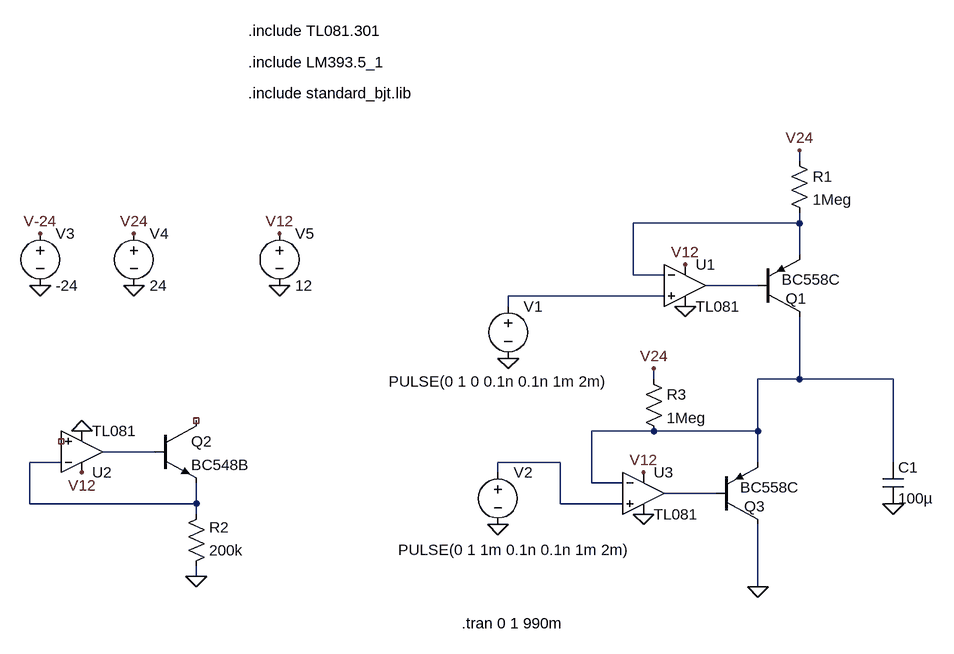
[diagram p0: schematic Fuentes_salida_flipflop.asc]
Fuentes_salida_flipflop.asc, the LTspice schematic file:
Version 4
SHEET 1 1304 908
WIRE 464 -64 464 -80
WIRE 464 32 464 16
WIRE 464 32 208 32
WIRE 464 80 464 32
WIRE 208 112 208 32
WIRE 256 112 208 112
WIRE 400 128 320 128
WIRE 256 144 16 144
WIRE 16 160 16 144
WIRE 240 272 240 256
WIRE 464 272 464 176
WIRE 464 272 400 272
WIRE 608 272 464 272
WIRE 240 352 144 352
WIRE 400 352 400 272
WIRE 400 352 240 352
WIRE -528 384 -608 384
WIRE -672 400 -720 400
WIRE 96 400 0 400
WIRE 400 400 400 352
WIRE 608 400 608 272
WIRE 0 416 0 400
WIRE 144 432 144 352
WIRE 192 432 144 432
WIRE 336 448 256 448
WIRE -720 464 -720 400
WIRE -464 464 -464 432
WIRE -464 464 -720 464
WIRE 96 464 96 400
WIRE 192 464 96 464
WIRE -464 480 -464 464
WIRE -464 576 -464 560
WIRE 400 592 400 496
FLAG 608 464 0
FLAG 464 -80 V24
FLAG 288 160 0
FLAG -640 352 0
FLAG 288 96 V12
FLAG -640 416 V12
FLAG 0 496 0
FLAG 16 240 0
FLAG -704 128 0
FLAG -560 128 0
FLAG -704 48 V-24
FLAG -560 48 V24
FLAG -336 128 0
FLAG -336 48 V12
FLAG -464 576 0
FLAG 240 256 V24
FLAG 224 480 0
FLAG 224 416 V12
FLAG 400 592 0
SYMBOL cap 592 400 R0
SYMATTR InstName C1
SYMATTR Value 100µ
SYMBOL Opamps\\opamp2 288 64 R0
SYMATTR InstName U1
SYMATTR Value TL081
SYMBOL Opamps\\opamp2 -640 448 M180
SYMATTR InstName U2
SYMATTR Value TL081
SYMBOL pnp 400 176 M180
WINDOW 0 43 28 Left 2
WINDOW 3 37 57 Left 2
SYMATTR InstName Q1
SYMATTR Value BC558C
SYMBOL res 448 -80 R0
SYMATTR InstName R1
SYMATTR Value 1Meg
SYMBOL res -480 576 M180
WINDOW 0 36 76 Left 2
WINDOW 3 36 40 Left 2
SYMATTR InstName R2
SYMATTR Value 200k
SYMBOL npn -528 336 R0
SYMATTR InstName Q2
SYMATTR Value BC548B
SYMBOL voltage 16 144 R0
WINDOW 123 0 0 Left 0
WINDOW 39 0 0 Left 0
WINDOW 3 -184 132 Left 2
SYMATTR InstName V1
SYMATTR Value PULSE(0 1 0 0.1n 0.1n 1m 2m)
SYMBOL voltage 0 400 R0
WINDOW 123 0 0 Left 0
WINDOW 39 0 0 Left 0
WINDOW 3 -153 135 Left 2
SYMATTR InstName V2
SYMATTR Value PULSE(0 1 1m 0.1n 0.1n 1m 2m)
SYMBOL voltage -704 32 R0
WINDOW 123 0 0 Left 0
WINDOW 39 0 0 Left 0
SYMATTR InstName V3
SYMATTR Value -24
SYMBOL voltage -560 32 R0
WINDOW 123 0 0 Left 0
WINDOW 39 0 0 Left 0
SYMATTR InstName V4
SYMATTR Value 24
SYMBOL voltage -336 32 R0
WINDOW 123 0 0 Left 0
WINDOW 39 0 0 Left 0
SYMATTR InstName V5
SYMATTR Value 12
SYMBOL Opamps\\opamp2 224 384 R0
SYMATTR InstName U3
SYMATTR Value TL081
SYMBOL pnp 336 496 M180
WINDOW 0 43 28 Left 2
WINDOW 3 37 57 Left 2
SYMATTR InstName Q3
SYMATTR Value BC558C
SYMBOL res 224 256 R0
SYMATTR InstName R3
SYMATTR Value 1Meg
TEXT -56 648 Left 2 !.tran 0 1 990m
TEXT -384 -168 Left 2 !.include standard_bjt.lib
TEXT -384 -216 Left 2 !.include LM393.5_1
TEXT -384 -264 Left 2 !.include TL081.301

The netlist it stands for:
* Fuentes_salida_flipflop.asc
C1 N004 0 100µ
XU1 N003 N001 V12 0 N002 TL081  ; pins In+ In- V+ V- OUT
XU2 NC_01 N006 V12 0 N005 TL081  ; pins In+ In- V+ V- OUT
Q1 N004 N002 N001 0 BC558C
R1 V24 N001 1Meg
R2 0 N006 200k
Q2 NC_02 N005 N006 0 BC548B
V1 N003 0 PULSE(0 1 0 0.1n 0.1n 1m 2m)
V2 N007 0 PULSE(0 1 1m 0.1n 0.1n 1m 2m)
V3 V-24 0 -24
V4 V24 0 24
V5 V12 0 12
XU3 N007 N004 V12 0 N008 TL081  ; pins In+ In- V+ V- OUT
Q3 0 N008 N004 0 BC558C
R3 V24 N004 1Meg
.model NPN NPN
.model PNP PNP
.lib standard.bjt
.tran 0 1 990m
.include standard_bjt.lib
.include LM393.5_1
.include TL081.301
.backanno
.end